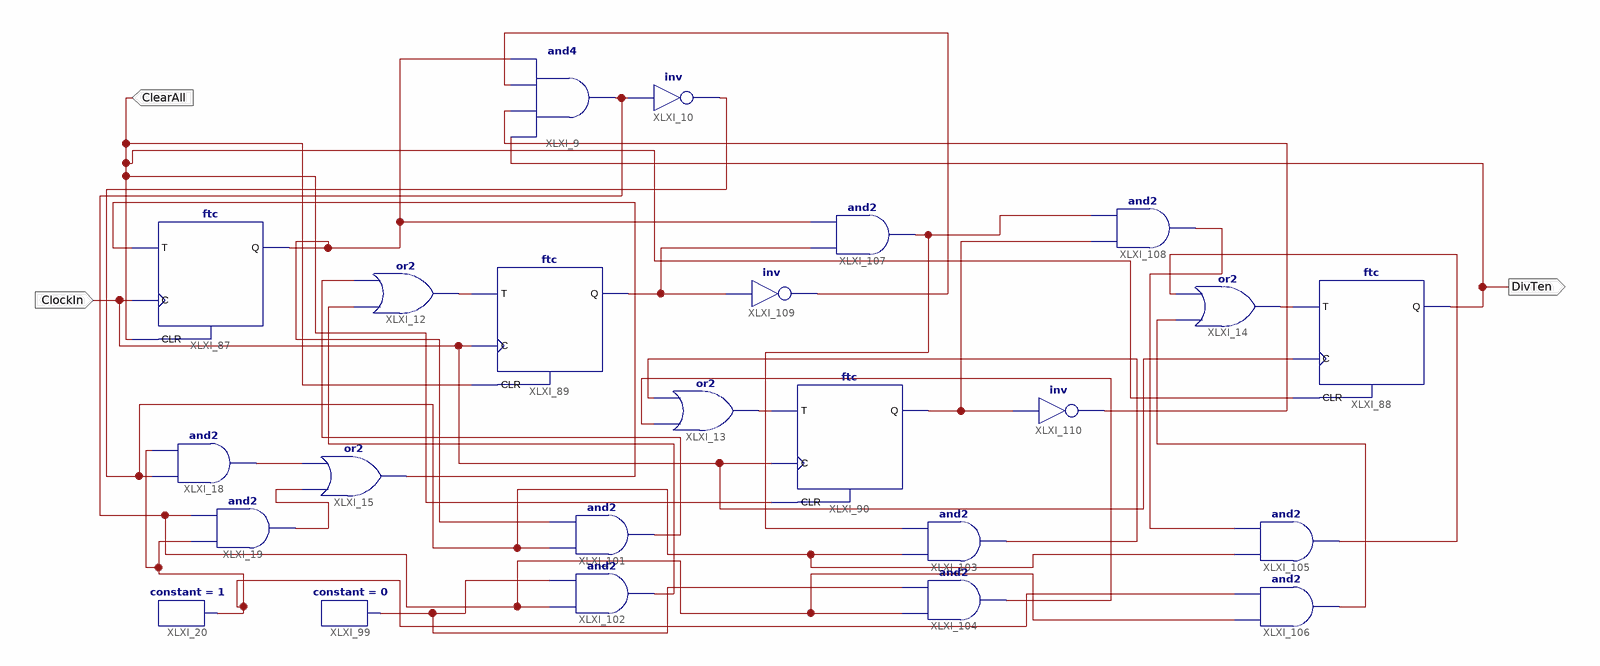
[diagram p0: schematic sheet 1]
// Xilinx ISE schematic PratikSrathak.sch (spartan6) as structural Verilog: 24 symbols, 3 ports
module PratikSrathak (
  input  ClockIn,
  input  ClearAll,
  output DivTen
);

  wire XLXN_4, XLXN_9, XLXN_22, XLXN_23, XLXN_24, XLXN_25, XLXN_27, XLXN_28, XLXN_29, XLXN_30, XLXN_31,
       XLXN_32, XLXN_33, XLXN_34, XLXN_217, XLXN_219, XLXN_221, XLXN_223, XLXN_224, XLXN_226, XLXN_228,
       XLXN_229, XLXN_230;

  ftc XLXI_87 (.C(ClockIn), .CLR(ClearAll), .T(XLXN_230), .Q(XLXN_217));
  ftc XLXI_88 (.C(ClockIn), .CLR(ClearAll), .T(XLXN_223), .Q(DivTen));
  ftc XLXI_89 (.C(ClockIn), .CLR(ClearAll), .T(XLXN_221), .Q(XLXN_25));
  ftc XLXI_90 (.C(ClockIn), .CLR(ClearAll), .T(XLXN_9), .Q(XLXN_28));
  and XLXI_9 (XLXN_226, DivTen, XLXN_219, XLXN_4, XLXN_217);
  not XLXI_10 (XLXN_228, XLXN_226);
  or XLXI_12 (XLXN_221, XLXN_23, XLXN_22);
  or XLXI_13 (XLXN_9, XLXN_30, XLXN_29);
  or XLXI_14 (XLXN_223, XLXN_34, XLXN_33);
  or XLXI_15 (XLXN_230, XLXN_224, XLXN_229);
  and XLXI_19 (XLXN_224, XLXN_27, XLXN_226);
  constant #(.CValue("1")) XLXI_20 (.O(XLXN_27));
  constant #(.CValue("0")) XLXI_99 (.O(XLXN_24));
  and XLXI_18 (XLXN_229, XLXN_228, XLXN_27);
  and XLXI_101 (XLXN_22, XLXN_228, XLXN_217);
  and XLXI_102 (XLXN_23, XLXN_226, XLXN_24);
  and XLXI_103 (XLXN_29, XLXN_228, XLXN_31);
  and XLXI_104 (XLXN_30, XLXN_226, XLXN_24);
  and XLXI_105 (XLXN_33, XLXN_228, XLXN_32);
  and XLXI_106 (XLXN_34, XLXN_226, XLXN_27);
  and XLXI_107 (XLXN_31, XLXN_25, XLXN_217);
  and XLXI_108 (XLXN_32, XLXN_28, XLXN_31);
  not XLXI_109 (XLXN_4, XLXN_25);
  not XLXI_110 (XLXN_219, XLXN_28);
endmodule
